# EAGLE schematic tnychron_1_3 (EAGLE 6.3)
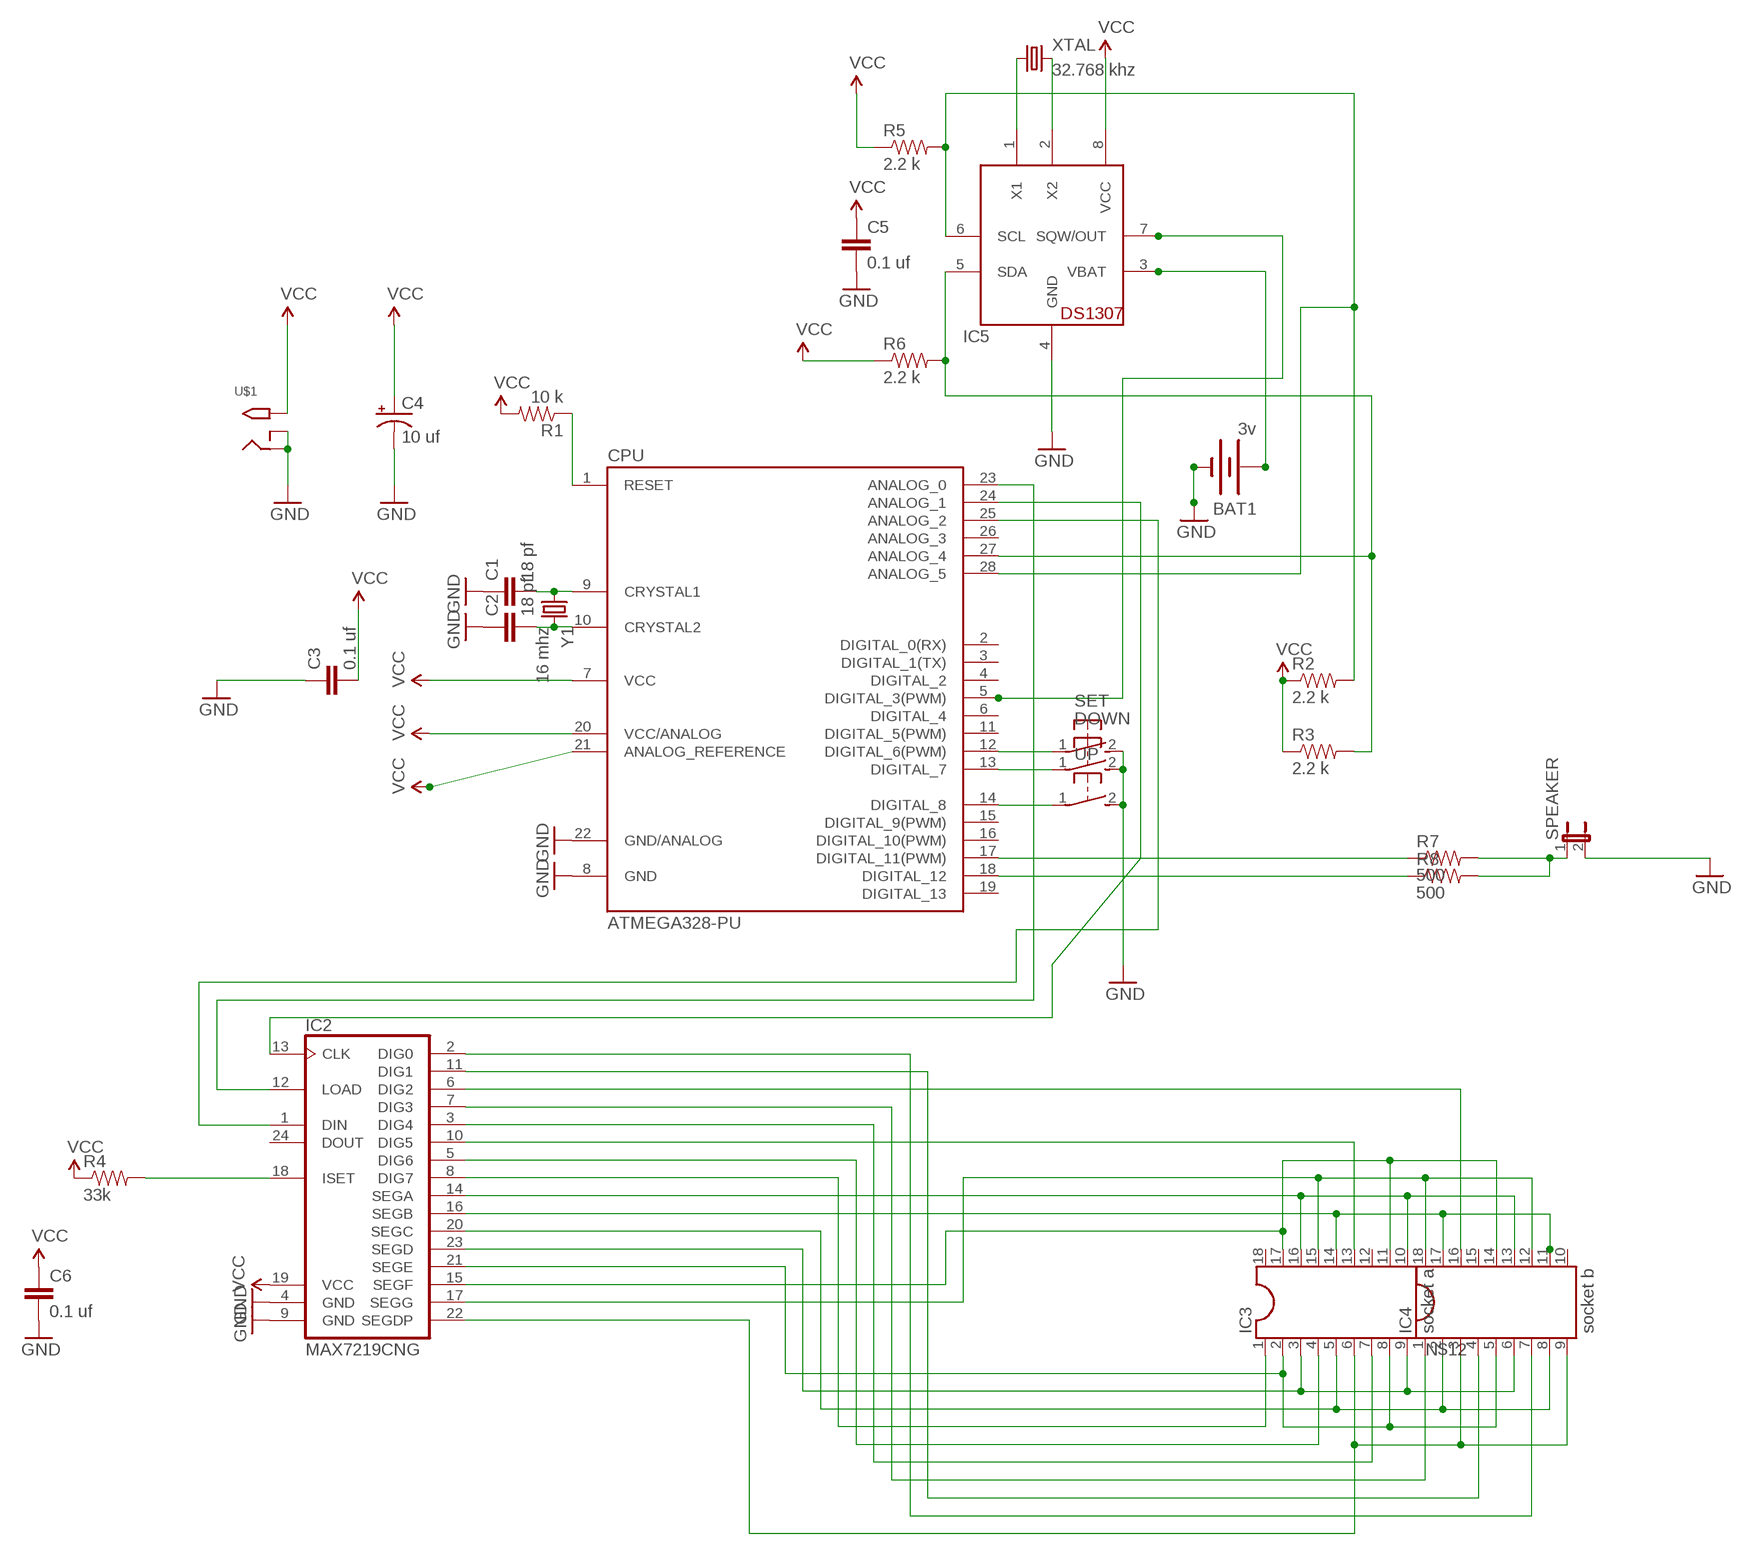
[diagram p0: schematic, sheet 1]

## Parts
BAT1  3v  BATTERY12PTH  [BATTCON_12MM_PTH]
C1  18 pf  CAPPTH2  [CAP-PTH-SMALL2]
C2  18 pf  CAPPTH2  [CAP-PTH-SMALL2]
C3  0.1 uf  CAPPTH2  [CAP-PTH-SMALL2]
C4  10 uf  CAP_POLPTH2  [CPOL-RADIAL-10UF-25V]
C5  0.1 uf  CAPPTH2  [CAP-PTH-SMALL2]
C6  0.1 uf  CAPPTH2  [CAP-PTH-SMALL2]
CPU  ATMEGA328-PU  ATMEGA168-PU  [DIL28-3]
DOWN  31-XX  [B3F-31XX]
IC2  MAX7219CNG  [DIL24-3]
IC3  socket a  DIL18  [DIL18]
IC4  socket b  DIL18  [DIL18]
IC5  DS1307  [DIL08]
R1  10 k  RESISTORPTH-1/4W  [AXIAL-0.4]
R2  2.2 k  RESISTORPTH-1/4W  [AXIAL-0.4]
R3  2.2 k  RESISTORPTH-1/4W  [AXIAL-0.4]
R4  33k  RESISTORPTH-1/4W  [AXIAL-0.4]
R5  2.2 k  RESISTORPTH-1/4W  [AXIAL-0.4]
R6  2.2 k  RESISTORPTH-1/4W  [AXIAL-0.4]
R7  500  RESISTORAXIAL-0.3  [AXIAL-0.3]
R8  500  RESISTORAXIAL-0.3  [AXIAL-0.3]
SET  31-XX  [B3F-31XX]
SPEAKER  JUMPER-2PTH  [1X02]
U$1  2.1MMJACKTHM  [PJ-102A]
UP  31-XX  [B3F-31XX]
XTAL  32.768 khz  CRYSTALTC26H  [TC26H]
Y1  16 mhz  CRYSTALHC49US  [HC49US]

## Nets
GND [supply]: BAT1.GND(-) C1.1 C2.1 C3.1 C4.2(-) C5.2 C6.2 CPU.8(GND) CPU.22(GND/ANALOG) DOWN.2(S) IC2.4(GND) IC2.9(GND) IC5.4(GND) SET.2(S) SPEAKER.2 U$1.RING U$1.RING_SW UP.2(S)
N$1: CPU.18(DIGITAL_12) R8.P$1
N$2: CPU.1(RESET) R1.P$1
N$3: C1.2 CPU.9(CRYSTAL1) Y1.1
N$4: C2.2 CPU.10(CRYSTAL2) Y1.2
N$5: IC2.2(DIG0) IC4.7
N$6: IC2.11(DIG1) IC4.4
N$7: CPU.28(ANALOG_5) IC5.6(SCL) R2.P$2 R5.P$2
N$8: CPU.27(ANALOG_4) IC5.5(SDA) R3.P$2 R6.P$2
N$9: CPU.5(DIGITAL_3(PWM)) IC5.7(SQW/OUT)
N$10: CPU.17(DIGITAL_11(PWM)) R7.P$1
N$11: IC2.6(DIG2) IC4.16
N$12: IC2.7(DIG3) IC4.1
N$13: IC2.18(ISET) R4.P$2
N$14: IC2.3(DIG4) IC3.7
N$15: CPU.23(ANALOG_0) IC2.12(LOAD)
N$16: CPU.24(ANALOG_1) IC2.13(CLK)
N$17: CPU.25(ANALOG_2) IC2.1(DIN)
N$18: IC2.10(DIG5) IC3.13
N$19: IC5.1(X1) XTAL.1
N$20: IC2.5(DIG6) IC3.4
N$21: IC2.8(DIG7) IC3.1
N$22 [supply]: BAT1.VCC@1(+) IC5.3(VBAT)
N$23: IC2.14(SEGA) IC3.10 IC3.16 IC4.13
N$24: IC2.16(SEGB) IC3.14 IC4.11 IC4.17
N$25: IC2.20(SEGC) IC3.5 IC4.2 IC4.8
N$26: IC2.23(SEGD) IC3.3 IC3.9 IC4.6
N$27: IC2.21(SEGE) IC3.2 IC3.8 IC4.5
N$28: CPU.12(DIGITAL_6(PWM)) SET.1(P)
N$29: CPU.13(DIGITAL_7) DOWN.1(P)
N$30: IC2.15(SEGF) IC3.11 IC3.17 IC4.14
N$31: IC2.17(SEGG) IC3.15 IC4.12 IC4.18
N$32: IC2.22(SEGDP) IC3.6 IC4.3 IC4.9
N$33: CPU.14(DIGITAL_8) UP.1(P)
N$34: R7.P$2 R8.P$2 SPEAKER.1
N$35: IC5.2(X2) XTAL.2
VCC [supply]: C3.2 C4.1(+) C5.1 C6.1 CPU.7(VCC) CPU.20(VCC/ANALOG) CPU.21(ANALOG_REFERENCE) IC2.19(VCC) IC5.8(VCC) R1.P$2 R2.P$1 R3.P$1 R4.P$1 R5.P$1 R6.P$1 U$1.TIP
Unconnected: CPU.2(DIGITAL_0(RX)) CPU.3(DIGITAL_1(TX)) CPU.4(DIGITAL_2) CPU.6(DIGITAL_4) CPU.11(DIGITAL_5(PWM)) CPU.15(DIGITAL_9(PWM)) CPU.16(DIGITAL_10(PWM)) CPU.19(DIGITAL_13) CPU.26(ANALOG_3) IC2.24(DOUT) IC3.12 IC3.18 IC4.10 IC4.15

## Library data of the parts
BAT1 = SparkFun:BATTERY: Battery Holders Various common sizes : AA, AAA, 20mm coin cell and 12mm coin cell.
C1-C3 C5 C6 = SparkFun:CAP: Capacitor Standard 0603 ceramic capacitor, and 0.1" leaded capacitor.
C4 = SparkFun:CAP_POL: Capacitor Polarized These are standard SMD and PTH capacitors. Normally 10uF, 47uF, and 100uF in electrolytic and tantalum varieties. Always verify the external diameter of the through hole cap, it varies with capacity, voltage, and manufacturer. The EIA devices should be standard.
CPU = Arduino-AVR:ATMEGA168-PU
DOWN SET UP = adafruit:31-XX: OMRON SWITCH Now with beefier pads!
IC2 = maxim:MAX7219CNG: LED DISPLAY DRIVER; MF: MAXIM; MPN: MAX7219CNG; OC_FARNELL: 1523914; OC_NEWARK: 34C4018
IC3 IC4 = ic-package:DIL18: Dual In Line / Socket
IC5 = adafruit:DS1307: DS1307 Real time clock (RTC) with battery backup ability. Talk to it via i2c
R1-R8 = SparkFun:RESISTOR: Resistor Basic schematic elements and footprints for 0603, 1206, and PTH resistors.
SPEAKER = SparkFun:JUMPER-2: Jumper Basic 0.1" spaced jumper. Use with breakaway headers.
U$1 = adafruit:2.1MMJACK: 2.1mm x 5.5mm THM DC jack with internal switch. Digikey part #PJ-102A, 4UCON part #05537 2.1mm x 5.5mm SMT DC jack with internal switch. Digikey part #PJ-002A-SMT, 4UCON part #03267 By microbuilder.eu & adafruit.com
XTAL Y1 = SparkFun:CRYSTAL: Crystals Various standard crystals. Proven footprints. Spark Fun Electronics SKU : COM-00534

## Net classes
0 default: width 0.406 mm
1 supply: width 1.143 mm